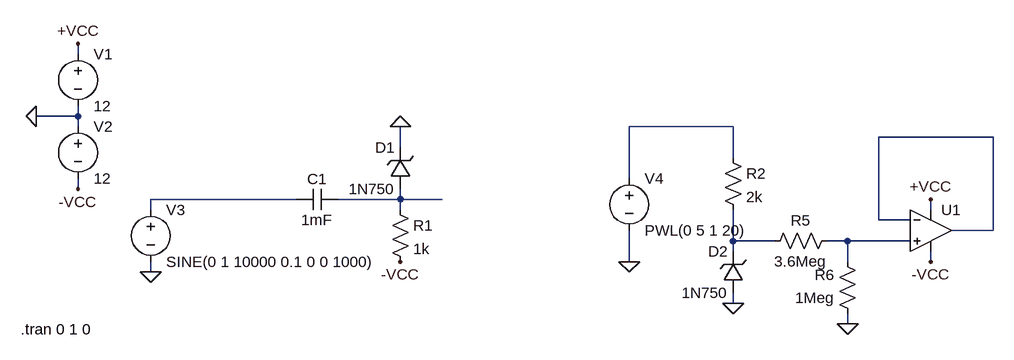
[diagram p0: schematic voltagereference.asc]
voltagereference.asc, the LTspice schematic file:
Version 4
SHEET 1 1984 680
WIRE 64 144 64 128
WIRE 64 240 64 224
WIRE 64 240 0 240
WIRE 64 256 64 240
WIRE 1072 256 912 256
WIRE 1472 272 1296 272
WIRE 560 288 560 256
WIRE 1072 304 1072 256
WIRE 912 336 912 256
WIRE 64 352 64 336
WIRE 400 368 176 368
WIRE 560 368 560 352
WIRE 560 368 464 368
WIRE 624 368 560 368
WIRE 176 384 176 368
WIRE 560 384 560 368
WIRE 1376 384 1376 368
WIRE 1296 400 1296 272
WIRE 1344 400 1296 400
WIRE 1472 416 1472 272
WIRE 1472 416 1408 416
WIRE 1072 432 1072 384
WIRE 1136 432 1072 432
WIRE 1248 432 1216 432
WIRE 1344 432 1248 432
WIRE 1072 448 1072 432
WIRE 912 464 912 416
WIRE 1248 464 1248 432
WIRE 1376 464 1376 448
WIRE 176 480 176 464
WIRE 1072 528 1072 512
WIRE 1248 560 1248 544
FLAG 0 240 0
FLAG 64 352 -VCC
FLAG 64 128 +VCC
FLAG 560 256 0
FLAG 560 464 -VCC
FLAG 176 480 0
FLAG 912 464 0
FLAG 1072 528 0
FLAG 1376 464 -VCC
FLAG 1376 368 +VCC
FLAG 1248 560 0
SYMBOL voltage 64 128 R0
WINDOW 123 0 0 Left 0
WINDOW 39 0 0 Left 0
SYMATTR InstName V1
SYMATTR Value 12
SYMBOL voltage 64 240 R0
WINDOW 123 0 0 Left 0
WINDOW 39 0 0 Left 0
SYMATTR InstName V2
SYMATTR Value 12
SYMBOL zener 576 352 R180
WINDOW 0 24 64 Left 2
WINDOW 3 24 0 Left 2
SYMATTR InstName D1
SYMATTR Value 1N750
SYMATTR Description Diode
SYMATTR Type diode
SYMBOL res 544 368 R0
SYMATTR InstName R1
SYMATTR Value 1k
SYMBOL cap 464 352 R90
WINDOW 0 0 32 VBottom 2
WINDOW 3 32 32 VTop 2
SYMATTR InstName C1
SYMATTR Value 1mF
SYMBOL voltage 176 368 R0
WINDOW 123 0 0 Left 0
WINDOW 39 0 0 Left 0
SYMATTR InstName V3
SYMATTR Value SINE(0 1 10000 0.1 0 0 1000)
SYMBOL zener 1088 512 R180
WINDOW 0 24 64 Left 2
WINDOW 3 24 0 Left 2
SYMATTR InstName D2
SYMATTR Value 1N750
SYMATTR Description Diode
SYMATTR Type diode
SYMBOL res 1056 288 R0
SYMATTR InstName R2
SYMATTR Value 2k
SYMBOL voltage 912 320 R0
WINDOW 123 0 0 Left 0
WINDOW 39 0 0 Left 0
SYMATTR InstName V4
SYMATTR Value PWL(0 5 1 20)
SYMBOL OpAmps\\UniversalOpAmp2 1376 416 R0
SYMATTR InstName U1
SYMBOL res 1232 416 R90
WINDOW 0 0 56 VBottom 2
WINDOW 3 32 56 VTop 2
SYMATTR InstName R5
SYMATTR Value 3.6Meg
SYMBOL res 1264 560 R180
WINDOW 0 36 76 Left 2
WINDOW 3 36 40 Left 2
SYMATTR InstName R6
SYMATTR Value 1Meg
TEXT -24 568 Left 2 !.tran 0 1 0

The netlist it stands for:
* voltagereference.asc
V1 +VCC 0 12
V2 0 -VCC 12
D1 N004 0 1N750
R1 N004 -VCC 1k
C1 N004 N003 1mF
V3 N003 0 SINE(0 1 10000 0.1 0 0 1000)
D2 0 N005 1N750
R2 N001 N005 2k
V4 N001 0 PWL(0 5 1 20)
XU1 N006 N002 +VCC -VCC N002 level2 Avol=1Meg GBW=10Meg Slew=10Meg Ilimit=25m Rail=0 Vos=0 En=0 Enk=0 In=0 Ink=0 Rin=500Meg  ; pins In+ In- V+ V- OUT
R5 N006 N005 3.6Meg
R6 0 N006 1Meg
.model D D
.lib standard.dio
.tran 0 1 0
.lib UniversalOpAmp2.lib
.backanno
.end